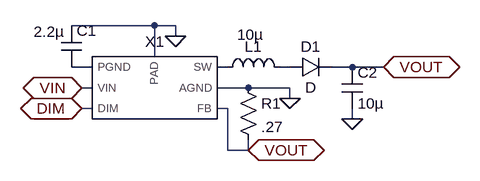
[diagram p0: schematic Boost.asc]
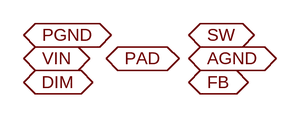
[diagram p1: sub-circuit boostcontroller.asc]
Boost.asc, the LTspice schematic file:
Version 4
SHEET 1 880 680
WIRE 128 112 0 112
WIRE 160 112 128 112
WIRE 160 128 160 112
WIRE 128 160 128 112
WIRE 32 176 0 176
WIRE 240 176 224 176
WIRE 336 176 320 176
WIRE 432 176 400 176
WIRE 480 176 432 176
WIRE 32 208 16 208
WIRE 272 208 224 208
WIRE 336 208 272 208
WIRE 336 224 336 208
WIRE 32 240 16 240
WIRE 240 240 224 240
WIRE 432 256 432 240
WIRE 240 304 240 240
WIRE 272 304 272 288
WIRE 272 304 240 304
FLAG 336 224 0
FLAG 432 256 0
FLAG 160 128 0
FLAG 480 176 VOUT
IOPIN 480 176 BiDir
FLAG 16 240 DIM
IOPIN 16 240 BiDir
FLAG 16 208 VIN
IOPIN 16 208 BiDir
FLAG 272 304 VOUT
IOPIN 272 304 BiDir
SYMBOL cap -16 112 R0
WINDOW 3 -42 9 Left 2
SYMATTR InstName C1
SYMATTR Value 2.2µ
SYMBOL cap 416 176 R0
SYMATTR InstName C2
SYMATTR Value 10µ
SYMBOL res 256 192 R0
SYMATTR InstName R1
SYMATTR Value .27
SYMBOL ind 224 192 R270
WINDOW 0 32 56 VTop 2
WINDOW 3 82 51 VBottom 2
SYMATTR InstName L1
SYMATTR Value 10µ
SYMBOL diode 336 192 R270
WINDOW 0 32 32 VTop 2
WINDOW 3 0 32 VBottom 2
SYMATTR InstName D1
SYMBOL FriedRice\\BoostController 128 272 R0
SYMATTR InstName X1

boostcontroller.asc, the sub-circuit schematic file:
Version 4
SHEET 1 880 680
FLAG 256 112 PGND
IOPIN 256 112 BiDir
FLAG 256 144 VIN
IOPIN 256 144 BiDir
FLAG 256 176 DIM
IOPIN 256 176 BiDir
FLAG 368 144 PAD
IOPIN 368 144 BiDir
FLAG 480 112 SW
IOPIN 480 112 BiDir
FLAG 480 144 AGND
IOPIN 480 144 BiDir
FLAG 480 176 FB
IOPIN 480 176 BiDir

The netlist it stands for:
* Boost.asc
C1 0 N001 2.2µ
C2 VOUT 0 10µ
R1 0 VOUT .27
L1 N002 N003 10µ
D1 N003 VOUT D
XX1 N001 VIN DIM VOUT 0 N002 0 boostcontroller

* block symbol definitions
.subckt boostcontroller PGND VIN DIM FB AGND SW PAD
.ends boostcontroller

.model D D
.lib standard.dio
.backanno
.end